# Altium schematic sheet logi-edu.SchDoc: LOGi - EDU
size B; Engineer: M. Jones; Organization: Michael Jones; DocumentNumber: 2; Revision: RA.1; SheetNumber: 2; SheetTotal: 2; PageSetup: Record=PageOptions|CenterHorizontal=True|CenterVertical=True|PrintScale=0.70|XCorrection=1.00|YCorrection=1.00|PrintKind=0|BorderSize=5000000|LeftOffset=0|BottomOffset=0|Orientation=2|PaperLength=1000|PaperWidth=1000|Scale=100|PaperSource=7|PrintQuality=-4|MediaType=1|DitherType=10|PaperKind=Letter|PrintScaleMode=1
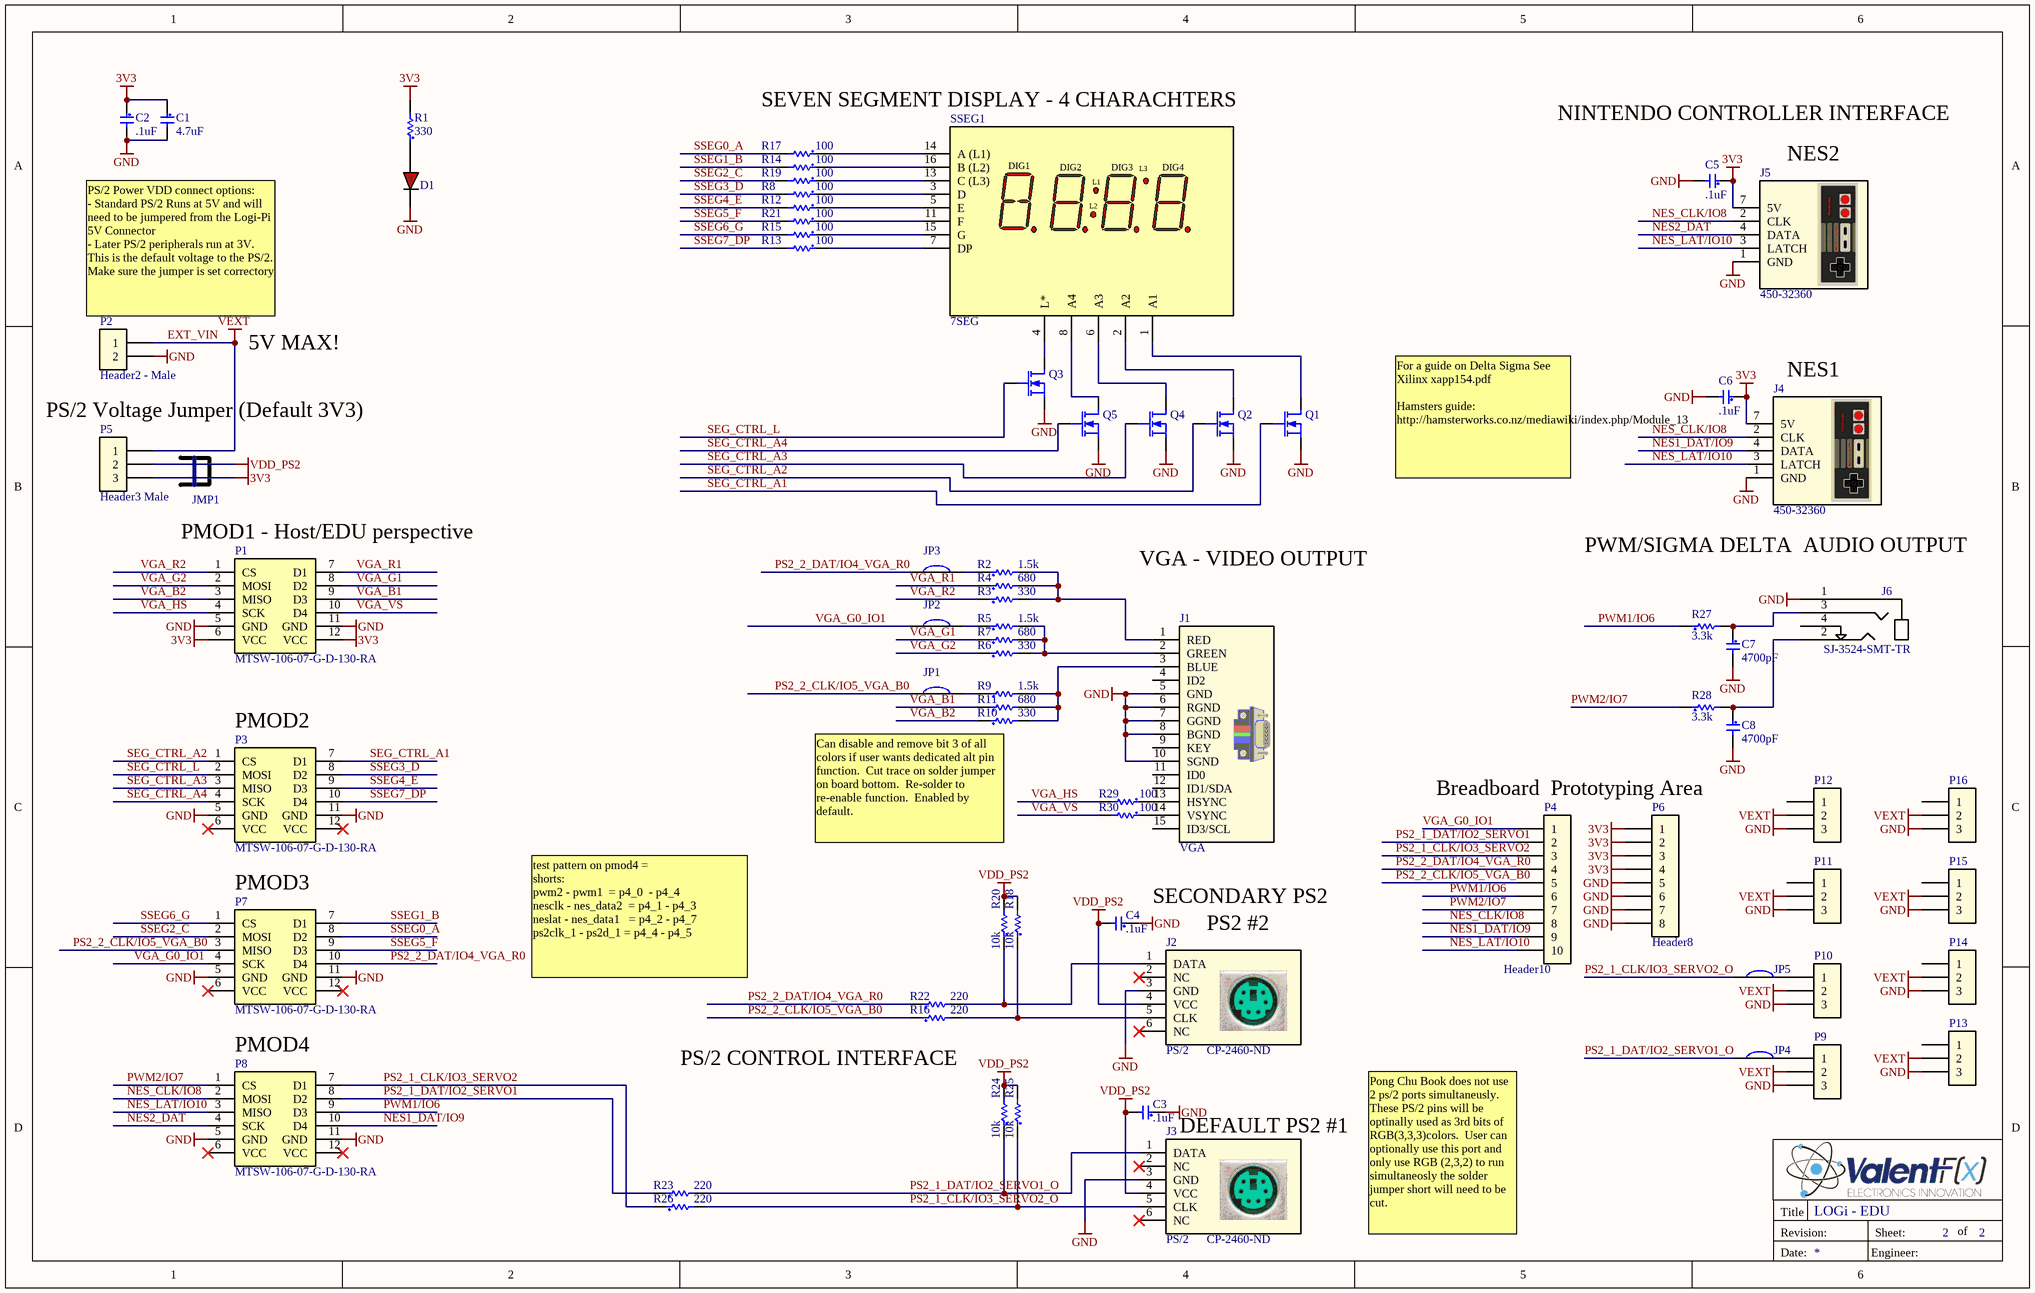
[diagram p0: logi-edu.SchDoc]

## Parts
C1  4.7uF  [C0603]
C2  .1uF  [C0603]
C3  .1uF  [C0603]
C4  .1uF  [C0603]
C5  .1uF  [C0603]
C6  .1uF  [C0603]
C7  4700pF  [C1206]
C8  4700pF  [C1206]
D1  598-8010-107F  [LED_0603 - RED]  (value not drawn)
J1  VGA  [1-1734530-1]
J2  PS/2  Supplier Part Number 1: CP-2460-ND  [MD-60S - PS/2]
J3  PS/2  Supplier Part Number 1: CP-2460-ND  [MD-60S - PS/2]
J4  450-32360  [NES - 450-32360]
J5  450-32360  [NES - 450-32360]
J6  SJ-3524-SMT-TR  [SJ-3524-SMT]
JMP1  Header Jumper  (value not drawn)  (mechanical)
JP1  Solder Jumper-NC  [SOLDER_JUMPER-NC]  (value not drawn)  (net tie, no BOM)
JP2  Solder Jumper-NC  [SOLDER_JUMPER-NC]  (value not drawn)  (net tie, no BOM)
JP3  Solder Jumper-NC  [SOLDER_JUMPER-NC]  (value not drawn)  (net tie, no BOM)
JP4  Solder Jumper-NC  [SOLDER_JUMPER-NC]  (value not drawn)  (net tie, no BOM)
JP5  Solder Jumper-NC  [SOLDER_JUMPER-NC]  (value not drawn)  (net tie, no BOM)
P1  MTSW-106-07-G-D-130-RA  [PMOD HEADER - Male]
P2  Header2 - Male  [HDR - PRPC002SAAN-RC]
P3  MTSW-106-07-G-D-130-RA  [PMOD HEADER - Male]
P4  Header10  [HEADER_10_40_100THRU SIP]  (no BOM)
P5  Header3 Male  [HDR - PRPC003SAAN-RC]
P6  Header8  [HEADER_8_40_100THRU SIP]  (no BOM)
P7  MTSW-106-07-G-D-130-RA  [PMOD HEADER - Male]
P8  MTSW-106-07-G-D-130-RA  [PMOD HEADER - Male]
P9  Header3 Male  [HDR - PRPC003SAAN-RC]  (value not drawn)
P10  Header3 Male  [HDR - PRPC003SAAN-RC]  (value not drawn)
P11  Header3 Male  [HDR - PRPC003SAAN-RC]  (value not drawn)
P12  Header3 Male  [HDR - PRPC003SAAN-RC]  (value not drawn)
P13  Header3 Male  [HDR - PRPC003SAAN-RC]  (value not drawn)
P14  Header3 Male  [HDR - PRPC003SAAN-RC]  (value not drawn)
P15  Header3 Male  [HDR - PRPC003SAAN-RC]  (value not drawn)
P16  Header3 Male  [HDR - PRPC003SAAN-RC]  (value not drawn)
Q1  DMN65D8L-7  [sot-23]  (value not drawn)
Q2  DMN65D8L-7  [sot-23]  (value not drawn)
Q3  DMN65D8L-7  [sot-23]  (value not drawn)
Q4  DMN65D8L-7  [sot-23]  (value not drawn)
Q5  DMN65D8L-7  [sot-23]  (value not drawn)
R1  330  [R0603]
R2  1.5k  [R0603]
R3  330  [R0603]
R4  680  [R0603]
R5  1.5k  [R0603]
R6  330  [R0603]
R7  680  [R0603]
R8  100  [R0603]
R9  1.5k  [R0603]
R10  330  [R0603]
R11  680  [R0603]
R12  100  [R0603]
R13  100  [R0603]
R14  100  [R0603]
R15  100  [R0603]
R16  220  [R0603]
R17  100  [R0603]
R18  10k  [R0603]
R19  100  [R0603]
R20  10k  [R0603]
R21  100  [R0603]
R22  220  [R0603]
R23  220  [R0603]
R24  10k  [R0603]
R25  10k  [R0603]
R26  220  [R0603]
R27  3.3k  [R1206]
R28  3.3k  [R1206]
R29  100  [R0603]
R30  100  [R0603]
SSEG1  7SEG  [LED - SSEG - LTC-4727JR]

## Nets
3V3: C1.1 C2.1 C5.1 C6.1 J4.7(5V) J5.7(5V) P1.6(VCC) P1.12(VCC) P5.3 P6.1 P6.2 P6.3 P6.4 R1.2
EXT_VIN: P2.1 P5.1 P9.2 P10.2 P11.2 P12.2 P13.2 P14.2 P15.2 P16.2  [also labelled VEXT]
GND: C1.2 C2.2 C3.1 C4.1 C5.2 C6.2 C7.2 C8.2 D1.C J1.5(GND) J1.6(RGND) J1.7(GGND) J1.8(BGND) J1.10(SGND) J2.3(GND) J3.3(GND) J4.1(GND) J5.1(GND) J6.1 P1.5(GND) P1.11(GND) P2.2 P3.5(GND) P3.11(GND) P6.5 P6.6 P6.7 P6.8 P7.5(GND) P7.11(GND) P8.5(GND) P8.11(GND) P9.3 P10.3 P11.3 P12.3 P13.3 P14.3 P15.3 P16.3 Q1.2 Q2.2 Q3.2 Q4.2 Q5.2
VDD_PS2: C3.2 C4.2 J2.4(VCC) J3.4(VCC) P5.2 R18.2 R20.2 R24.2 R25.2
NES1_DAT/IO9: J4.4(DATA) P4.9 P8.10(D4)
NES2_DAT: J5.4(DATA) P8.4(SCK)
NES_CLK/IO8: J4.2(CLK) J5.2(CLK) P4.8 P8.2(MOSI)
NES_LAT/IO10: J4.3(LATCH) J5.3(LATCH) P4.10 P8.3(MISO)
PS2_1_CLK/IO3_SERVO2: P4.3 P8.7(D1) R26.1
PS2_1_CLK/IO3_SERVO2_O: J3.5(CLK) JP5.1 R25.1 R26.2
PS2_1_DAT/IO2_SERVO1: P4.2 P8.8(D2) R23.1
PS2_1_DAT/IO2_SERVO1_O: J3.1(DATA) JP4.1 R23.2 R24.1
PS2_2_CLK/IO5_VGA_B0: JP1.1 P4.5 P7.3(MISO) R16.1
PS2_2_DAT/IO4_VGA_R0: JP3.1 P4.4 P7.10(D4) R22.1
PWM1/IO6: P4.6 P8.9(D3) R27.1
PWM2/IO7: P4.7 P8.1(CS) R28.1
SEG_CTRL_A1: P3.7(D1) Q1.1(G)
SEG_CTRL_A2: P3.1(CS) Q2.1(G)
SEG_CTRL_A3: P3.3(MISO) Q4.1(G)
SEG_CTRL_A4: P3.4(SCK) Q5.1(G)
SEG_CTRL_L: P3.2(MOSI) Q3.1(G)
SSEG0_A: P7.8(D2) R17.2
SSEG1_B: P7.7(D1) R14.2
SSEG2_C: P7.2(MOSI) R19.2
SSEG3_D: P3.8(D2) R8.2
SSEG4_E: P3.9(D3) R12.2
SSEG5_F: P7.9(D3) R21.2
SSEG6_G: P7.1(CS) R15.2
SSEG7_DP: P3.10(D4) R13.2
VGA_B1: P1.9(D3) R11.1
VGA_B2: P1.3(MISO) R10.1
VGA_G0_IO1: JP2.1 P4.1 P7.4(SCK)
VGA_G1: P1.8(D2) R7.1
VGA_G2: P1.2(MOSI) R6.1
VGA_HS: P1.4(SCK) R29.2
VGA_R1: P1.7(D1) R4.1
VGA_R2: P1.1(CS) R3.1
VGA_VS: P1.10(D4) R30.2
NetC7_1: C7.1 J6.3 R27.2
NetC8_1: C8.1 J6.2 R28.2
NetD1_A: D1.A R1.1
NetJ1_1: J1.1(RED) R2.2 R3.2 R4.2
NetJ1_2: J1.2(GREEN) R5.2 R6.2 R7.2
NetJ1_3: J1.3(BLUE) R9.2 R10.2 R11.2
NetJ1_13: J1.13(HSYNC) R29.1
NetJ1_14: J1.14(VSYNC) R30.1
NetJ2_1: J2.1(DATA) R20.1 R22.2
NetJ2_5: J2.5(CLK) R16.2 R18.1
NetJP1_2: JP1.2 R9.1
NetJP2_2: JP2.2 R5.1
NetJP3_2: JP3.2 R2.1
NetJP4_2: JP4.2 P9.1
NetJP5_2: JP5.2 P10.1
NetQ1_3: Q1.3(D) SSEG1.1(A1)
NetQ2_3: Q2.3(D) SSEG1.2(A2)
NetQ3_3: Q3.3(D) SSEG1.4(L*)
NetQ4_3: Q4.3(D) SSEG1.6(A3)
NetQ5_3: Q5.3(D) SSEG1.8(A4)
NetR8_1: R8.1 SSEG1.3(D)
NetR12_1: R12.1 SSEG1.5(E)
NetR13_1: R13.1 SSEG1.7(DP)
NetR14_1: R14.1 SSEG1.16(B_(L2))
NetR15_1: R15.1 SSEG1.15(G)
NetR17_1: R17.1 SSEG1.14(A_(L1))
NetR19_1: R19.1 SSEG1.13(C_(L3))
NetR21_1: R21.1 SSEG1.11(F)

Not connected (* = marked no-connect by the designer): J1 4(ID2) 9(KEY) 11(ID0) 12(ID1/SDA) 15(ID3/SCL); J2 2(NC)* 6(NC)*; J3 2(NC)* 6(NC)*; J6 4; P3 6(VCC)* 12(VCC)*; P7 6(VCC)* 12(VCC)*; P8 6(VCC)* 12(VCC)*; P11 1; P12 1; P13 1; P14 1; P15 1; P16 1

## Notes on the sheet
- SEVEN SEGMENT DISPLAY - 4 CHARACHTERS
- NINTENDO CONTROLLER INTERFACE
- NES2
- (near P2) PS/2 Power VDD connect options:
  - Standard PS/2 Runs at 5V and will need to be jumpered from the Logi-Pi 5V Connector
  - Later PS/2 peripherals run at 3V.  This is the default voltage to the PS/2.  Make sure the jumper is set correctory
- 5V MAX!
- PS/2 Voltage Jumper (Default 3V3)
- NES1
- For a guide on Delta Sigma See Xilinx xapp154.pdf
  Hamsters guide:
  http://hamsterworks.co.nz/mediawiki/index.php/Module_13
- (near P1) PMOD1 - Host/EDU perspective
- VGA - VIDEO OUTPUT
- PWM/SIGMA DELTA  AUDIO OUTPUT
- (near P3) PMOD2
- (near R10) Can disable and remove bit 3 of all colors if user wants dedicated alt pin function.  Cut trace on solder jumper on board bottom.  Re-solder to re-enable function.  Enabled by default.
- Breadboard  Prototyping Area
- PMOD3
- (near C4) SECONDARY PS2
- test pattern on pmod4 =
  shorts:
  pwm2 - pwm1 	= p4_0  - p4_4
  nesclk - nes_data2 	= p4_1 - p4_3
  neslat - nes_data1  	= p4_2 - p4_7
  ps2clk_1 - ps2d_1	= p4_4 - p4_5
- (near J2) PS2 #2
- PMOD4
- PS/2 CONTROL INTERFACE
- DEFAULT PS2 #1
- Pong Chu Book does not use 2 ps/2 ports simultaneusly.  These PS/2 pins will be optinally used as 3rd bits of RGB(3,3,3)colors.  User can optionally use this port and only use RGB (2,3,2) to run simultaneosly the solder jumper short will need to be cut.
- Title
- Revision:
- Sheet:
- of
- Date:
- Engineer:
- (in symbol LED - SSEG - LTC-4727JR) DIG1; DIG2; DIG3; L3; DIG4; L1; L2

## Library data of the parts
C1 = C0603 - GRM188F51A475ZE20D: 4.7uF 10volts Y5V +80-20% (MLCC) - SMD/SMT 0603; Manufacturer: Murata; Tolerance: - 20 %, + 80 %; Supplier 1: Mouser; Manufacturer Part Number: GRM188F51A475ZE20D; RoHS: RoHS Compliant By Exemption; Category: Multilayer Ceramic Capacitors (MLCC) - SMD/SMT; Stock 1: 32662; Pricing 1: 1=0.257, 50=0.159, 100=0.123, 500=0.065, 1000=0.046, 4000=0.032, 8000=0.028, 12000=0.024 (AUD); Capacitance: 4.7 uF; Dimensions: 0.8 mm W x 1.6 mm L x 0.8 mm H; Operating Temperature Range: - 30 C to + 85 C; Package / Case: 0603 (1608 metric); Packaging: Reel; Product: General Type MLCCs; Series: GRM; Termination Style: SMD/SMT; Voltage Rating: 10 Volts; Product Category: High Capacitance SMD Ceramic Chip Capacitors; Standard Pack Qty: 4000; Temperature Coefficient / Code: Y5V; RoHS - Mouser: E; Minimum Order Quantity: 1; Reeling: True; ComponentLink1URL: http://www.murata.com/products/catalog/pdf/c02e.pdf; ComponentLink1Description: http://www.murata.com/products/catalog/pdf/c02e.pdf; Supplier Part Number 1: 81-GRM188F51A475ZE20; Value: 4.7uF
C2-C6 = C0603 - GRM188R71H104KA93D: 0.1uF 50volts X7R 10% MLCC SMD/SMT 0603; Manufacturer: Murata; Supplier 1: Mouser; Manufacturer Part Number: GRM188R71H104KA93D; RoHS: RoHS Compliant By Exemption; Category: Multilayer Ceramic Capacitors (MLCC) - SMD/SMT; Stock 1: 327594; Pricing 1: 1=0.081, 50=0.054, 100=0.041, 500=0.018, 1000=0.015, 4000=0.012 (AUD); Capacitance: 0.1 uF; Dimensions: 0.8 mm W x 1.6 mm L x 0.8 mm H; Operating Temperature Range: - 55 C to + 125 C; Package / Case: 0603 (1608 metric); Packaging: Reel; Product: General Type MLCCs; Series: GRM; Termination Style: SMD/SMT; Tolerance: 10 %; Voltage Rating: 50 Volts; Product Category: Low & Medium Capacitance SMD Ceramic Chip Capacitors; Standard Pack Qty: 4000; Temperature Coefficient / Code: X7R; RoHS - Mouser: E; Minimum Order Quantity: 1; Reeling: True; ComponentLink1URL: http://www.murata.com/products/catalog/pdf/c02e.pdf; ComponentLink1Description: http://www.murata.com/products/catalog/pdf/c02e.pdf; Supplier Part Number 1: 81-GRM39X104K50D; Value: .1uF
C7 C8 = C1206 - C1206C472K5RACTU: CAP CER 4700PF 50V 10% X7R 1206; Manufacturer: Kemet; Supplier 1: Digi-Key; Manufacturer Part Number: C1206C472K5RACTU; RoHS: RoHS Compliant; Category: Capacitors; Stock 1: 41649; Pricing 1: 1=0.12, 10=0.085, 50=0.0484, 100=0.04, 250=0.03312, 500=0.02806, 1000=0.02323 (USD); Packaging: Cut Tape (CT); Capacitance: 4700pF; Voltage - Rated: 50V; Tolerance: ±10%; Temperature Coefficient: X7R; Mounting Type: Surface Mount, MLCC; Operating Temperature: -55°C ~ 125°C; Applications: General Purpose; Ratings: -; Package / Case: 1206 (3216 Metric); Size / Dimension: 0.126" L x 0.063" W (3.20mm x 1.60mm); Height - Seated (Max): -; Thickness (Max): 0.035" (0.88mm); Lead Spacing: -; Features: -; Lead Style: -; ComponentLink1URL: http://www.kemet.com/datasheets&C1206C472K5RACTU; ComponentLink1Description: http://www.kemet.com/datasheets&C1206C472K5RACTU; Supplier Part Number 1: 399-1230-1-ND; Value: 4700pF
D1 = LED0603 - 598-8010-107F: LED ALINGAP RED CLEAR 0603 SMD; Manufacturer: Dialight; Current - Test: 20mA; Wavelength - Dominant: 635nm; Millicandela Rating: 40mcd; Voltage - Forward (Vf) Typ: 2.2V; Lens Style/Size: Rectangle with Flat Top, 1.1mm x 0.8mm; Viewing Angle: 140°; Accept Replacement: YES - Water Clear; Supplier 1: Digi-Key; Manufacturer Part Number: 598-8010-107F; RoHS: RoHS Compliant; Category: Optoelectronics; Stock 1: 37578; Pricing 1: 1=0.45, 10=0.33, 25=0.264, 100=0.1749, 250=0.1452, 500=0.1056, 1000=0.0825 (USD); Color: Red; Luminous Flux @ Current - Test: -; Wavelength - Peak: -; Lens Type: Clear; Size / Dimension: 1.60mm L x 0.80mm W; Height: 0.70mm; Package / Case: 0603 (1608 Metric); Mounting Type: Surface Mount; Packaging: Digi-Reel®; ComponentLink1URL: http://media.digikey.com/pdf/Data%20Sheets/Dialight%20PDFs/598_Series_0603_Pkg.pdf; ComponentLink1Description: http://media.digikey.com/pdf/Data%20Sheets/Dialight%20PDFs/598_Series_0603_Pkg.pdf; Supplier Part Number 1: 350-2029-6-ND
J1 = VGA - 1-1734530-1: CONN HD D-SUB RCPT R/A 15POS; Manufacturer: TE Connectivity; Connector Style: D-Sub, High Density; Number of Positions: 15; Connector Type: Receptacle, Female Sockets; Flange Feature: Housing/Shell (4-40); Voltage Rating: 125V; Current Rating: 2A; Supplier 1: Digi-Key; Manufacturer Part Number: 1-1734530-1; RoHS: RoHS Compliant; Category: Connectors, Interconnects; Stock 1: 6957; Pricing 1: 1=1.96, 10=1.779, 25=1.67, 50=1.5976, 100=1.525, 250=1.37972, 500=1.2708, 1000=1.08926, 2500=1.01664 (USD); Number of Rows: 3; Shell Size, Connector Layout: 1 (DE, E) High Density; Contact Type: Signal; Mounting Type: Through Hole, Right Angle; Termination: Solder; Features: Board Lock; Shell Material, Finish: Steel, Nickel Plated; Contact Finish: Gold; Contact Finish Thickness: Flash; Ingress Protection: -; Operating Temperature: -55°C ~ 105°C; Housing Material: Thermoplastic; Color: Black; ComponentLink1URL: http://documents.tycoelectronics.com/commerce/DocumentDelivery/DDEController?Action=srchrtrv&DocNm=1734530&DocType=CD&DocLang=EN; ComponentLink1Description: http://documents.tycoelectronics.com/commerce/DocumentDelivery/DDEController?Action=srchrtrv&DocNm=1734530&DocType=CD&DocLang=EN
J2 J3 = Con - D-60S: CONN MINIDIN RECPT UNSHIELD 6POS - PS/2 mouse - keybaord; Manufacturer: CUI Inc; Manufacturer Part Number: MD-60S; Connector Type: Receptacle, Female Sockets; Number of Positions: 6; Current Rating: 2A; Voltage - Rated: 12VDC; Supplier 1: Digi-Key; RoHS: RoHS Compliant; Category: Connectors, Interconnects; Stock 1: 13581; Pricing 1: 1=1.31, 10=1.018, 100=0.7763, 500=0.621, 1000=0.552, 2500=0.45885 (USD); Shell Size - Insert: Mini DIN; Shell Size, MIL: -; Mounting Type: Through Hole, Right Angle; Termination: Solder; Fastening Type: Push-Pull; Orientation: Keyed; Ingress Protection: -; Shell Material, Finish: Polybutylene Terephthalate (PBT); Contact Finish: Silver; Features: -; Packaging: Bulk; Contact Finish Thickness: -; Operating Temperature: -; ComponentLink1URL: http://products.cui.com/GetSpecForDigiKey.aspx?MFGNum=MD-60S; ComponentLink1Description: http://products.cui.com/GetSpecForDigiKey.aspx?MFGNum=MD-60S; Value: PS/2
J4 J5 = 450-32360: NES CONTROLLER SOCKET; Manufacturer: Parallax Inc; Accessory Type: Adapter NES Controller Socket; For Use With/Related Products: Game Systems, Development, Hobby and Education Projects; Supplier 1: Digi-Key; Manufacturer Part Number: 450-32360; RoHS: RoHS Compliant; Category: Programmers, Development Systems; Stock 1: 7; Pricing 1: 1=1.99 (USD); Supplier 2: Mouser; Stock 2: 0; Pricing 2: 1=1.85 (USD); Product Category: Basic Stamp Accessories; RoHS - Mouser: Y; Minimum Order Quantity: 1; Reeling: False; Supplier Part Number 1: 450-32360-ND; Supplier Part Number 2: 619-450-32360; Value: 450-32360
J6 = SJ-3524-SMT-TR: CONN AUDIO JACK 3.5MM STEREO SMD; Manufacturer: CUI Inc; Connector Type: Phone Jack; Gender: Female; Plug/Mating Plug Diameter: 3.50mm (0.141", 1/8", Mini Plug) - Headphone; Number of Positions/Contacts: 3 Conductors, 4 Contacts; Internal Switch(s): Single Switch; Shielding: Unshielded; Color - Contact: Black; Voltage - Rated: 12VDC; Current Rating: 1A; Supplier 1: Digi-Key; Manufacturer Part Number: SJ-3524-SMT-TR; RoHS: RoHS Compliant; Category: Connectors, Interconnects; Stock 1: 49906; Pricing 1: 1=1.37, 10=1.063, 100=0.811, 500=0.64746 (USD); Packaging: Digi-Reel®; Signal Lines: Stereo; Mounting Type: Surface Mount, Right Angle; Termination: Solder; Features: -; Contact Material: Brass; Contact Material - Plating: Silver; Housing Material: Plastic; Housing Color: Black; Operating Temperature: -25°C ~ 85°C; ComponentLink1URL: http://www.cui.com/product/resource/digikeypdf/sj-352x-smt_series.pdf; ComponentLink1Description: http://www.cui.com/product/resource/digikeypdf/sj-352x-smt_series.pdf; Supplier Part Number 1: CP-3524SJDKR-ND
JMP1 = JMP - PC02SYAN: CONN JUMPER SHORTING GOLD FLASH; Manufacturer: Sullins Connector Solutions; Manufacturer Part Number: SPC02SYAN; Gender: Female Sockets; Number of Positions or Pins (Grid): 2 (1 x 2); Pitch: 0.100" (2.54mm); Supplier 1: Digi-Key; RoHS: RoHS Compliant; Category: Connectors, Interconnects; Stock 1: 178937; Pricing 1: 1=0.13, 10=0.077, 25=0.0548, 50=0.0448, 100=0.0385, 250=0.03256, 500=0.0301, 1000=0.0266, 2500=0.021 (USD); Packaging: Bulk; Type: Closed Top; Height: 0.256" (6.50mm); Contact Finish: Gold; Contact Finish Thickness: Flash; Color: Black; ComponentLink1URL: http://www.sullinscorp.com/drawings/134_C02SYAN_11134.pdf; ComponentLink1Description: http://www.sullinscorp.com/drawings/134_C02SYAN_11134.pdf; Supplier Part Number 1: S9001-ND; Value: Header Jumper
JP1-JP5 = Solder Jumper-NC: Solder/Configuration Jumper; Manufacturer: n/a; Manufacturer Part Number: n/a; Source: n/a; Source Part Number: n/a; ROHS Certificate: n/a
P1 P3 P7 P8 = P-MOD - MTSW-106-07-G-D-130-RA: Samtec Male Conn Unshrouded Header HDR 12 POS 2.54mm Solder RA Thru-Hole; Lead Time: 0 weeks; Peak Solder Temperature: 260 deg C; MSL (Moisture Sensitivity Level): N/R; Supplier 1: Arrow; Manufacturer: Samtec; Manufacturer Part Number: MTSW-106-07-G-D-130-RA; RoHS: CHINA ROHS: Compliant / EU ROHS: Compliant; Stock 1: 0; Termination Finish: Au/Ni; China ROHS Lead (X -> above / O -> below threshold): O; China ROHS Mercury (X -> above / O -> below threshold): O; China ROHS Cadmium (X -> above / O -> below threshold): O; China ROHS Hex Chromium (X -> above / O -> below threshold): O; China ROHS PBB (X -> above / O -> below threshold): O; China ROHS PBDE (X -> above / O -> below threshold): O; EU_ROHS_PROD_EXEMPTION_BY_SUPP: N/R; ComponentLink1URL: http://components.arrow.com/partservice/dataview/altium/2717179?apiKey=aa438727d59eed98c4bed826d8d949c84cb5e685b92bf87346a0226bd2658797; ComponentLink1Description: http://components.arrow.com/partservice/dataview/altium/2717179?apiKey=aa438727d59eed98c4bed826d8d949c84cb5e685b92bf87346a0226bd2658797; Supplier Part Number 1: 2717179; =Value: MTSW-106-07-G-D-130-RA; Value: MTSW-106-07-G-D-130-RA
P2 = HDR - PRPC002SAAN-RC: 2POS male CONN HEADER .100" SNGL STR; Manufacturer: Sullins Connector Solutions; Connector Type: Header, Unshrouded; Number of Positions: 2; Number of Positions Loaded: All; Pitch: 0.100" (2.54mm); Supplier 1: Digi-Key; Manufacturer Part Number: PRPC002SAAN-RC; RoHS: RoHS Compliant; Category: Connectors, Interconnects; Stock 1: 0; Pricing 1: 1=0.16, 10=0.145, 100=0.1198, 500=0.09466, 1000=0.08127, 5000=0.07414, 10000=0.07129 (USD); Packaging: Bulk; Contact Type: Male Pin; Number of Rows: 1; Row Spacing: -; Contact Mating Length: 0.230" (5.84mm); Mounting Type: Through Hole; Termination: Solder; Fastening Type: -; Features: -; Contact Finish: Gold; Contact Finish Thickness: Flash; Color: Black; ComponentLink1URL: http://media.digikey.com/PDF/Data%20Sheets/Sullins%20PDFs/xRxCzzzSxxN-RC_ST_11635-B.pdf; ComponentLink1Description: http://media.digikey.com/PDF/Data%20Sheets/Sullins%20PDFs/xRxCzzzSxxN-RC_ST_11635-B.pdf; Supplier Part Number 1: S1011EC-02-ND; Value: Header2 - Male
P4 = Header10: Header 10 pin
P5 P9-P16 = HDR - PRPC003SAAN-RC: 3POS Male CONN HEADER .100" SNGL STR; Manufacturer: Sullins Connector Solutions; Connector Type: Header, Unshrouded; Number of Positions: 3; Number of Positions Loaded: All; Pitch: 0.100" (2.54mm); Supplier 1: Digi-Key; Manufacturer Part Number: PRPC003SAAN-RC; RoHS: RoHS Compliant; Category: Connectors, Interconnects; Stock 1: 0; Pricing 1: 1=0.18, 10=0.16, 100=0.132, 500=0.10438, 1000=0.0896, 5000=0.08174, 10000=0.0786 (USD); Packaging: Bulk; Contact Type: Male Pin; Number of Rows: 1; Row Spacing: -; Contact Mating Length: 0.230" (5.84mm); Mounting Type: Through Hole; Termination: Solder; Fastening Type: -; Features: -; Contact Finish: Gold; Contact Finish Thickness: Flash; Color: Black; ComponentLink1URL: http://media.digikey.com/PDF/Data%20Sheets/Sullins%20PDFs/xRxCzzzSxxN-RC_ST_11635-B.pdf; ComponentLink1Description: http://media.digikey.com/PDF/Data%20Sheets/Sullins%20PDFs/xRxCzzzSxxN-RC_ST_11635-B.pdf; Value: Header3 Male
P6 = Header8: Header 8 pin
Q1-Q5 = NMOS - DMN65D8L-7: MOSFET N-CH 60V 310MA SOT23; Manufacturer: Diodes Incorporated; FET Type: MOSFET N-Channel, Metal Oxide; FET Feature: Logic Level Gate; Rds On (Max) @ Id, Vgs: 3 Ohm @ 115mA, 10V; Vgs(th) (Max) @ Id: 2V @ 250µA; Gate Charge (Qg) @ Vgs: 0.87nC @ 10V; Input Capacitance (Ciss) @ Vds: 22pF @ 25V; Power - Max: 370mW; Current - Continuous Drain (Id) @ 25°C: 310mA (Ta); Supplier 1: Digi-Key; Manufacturer Part Number: DMN65D8L-7; RoHS: RoHS Compliant; Category: Discrete Semiconductor Products; Stock 1: 44228; Pricing 1: 1=0.17, 10=0.156, 25=0.1416, 100=0.102, 250=0.06008, 500=0.04984, 1000=0.03399 (USD); Drain to Source Voltage (Vdss): 60V; Mounting Type: Surface Mount; Package / Case: TO-236-3, SC-59, SOT-23-3; Packaging: Cut Tape (CT); Supplier Device Package: SOT-23; ComponentLink1URL: http://www.diodes.com/datasheets/DMN65D8L.pdf; ComponentLink1Description: http://www.diodes.com/datasheets/DMN65D8L.pdf; Supplier Part Number 1: DMN65D8L-7DICT-ND; Value: DMN65D8L-7
R1 R3 R6 R10 = R0603 - ERJ-3EKF3300V: RES 330 OHM 1/10W 1% 0603 SMD; Manufacturer: Panasonic Electronic Components; Power (Watts): 0.1W, 1/10W; Temperature Coefficient: ±100ppm/°C; Supplier 1: Digi-Key; Manufacturer Part Number: ERJ-3EKF3300V; RoHS: RoHS Compliant; Category: Resistors; Stock 1: 205460; Pricing 1: 1=0.1, 50=0.015, 100=0.0114, 250=0.00844, 500=0.00624, 1000=0.00416, 2500=0.00351 (USD); Packaging: Cut Tape (CT); Resistance (Ohms): 330; Tolerance: ±1%; Composition: Thick Film; Features: -; Package / Case: 0603 (1608 Metric); Supplier Device Package: 0603; Size / Dimension: 0.063" L x 0.031" W (1.60mm x 0.80mm); Height: 0.022" (0.55mm); Number of Terminations: 2; ComponentLink1URL: http://industrial.panasonic.com/www-cgi/jvcr13pz.cgi?E+PZ+3+AOA0002+ERJ3EKF3300V+7+WW; ComponentLink1Description: http://industrial.panasonic.com/www-cgi/jvcr13pz.cgi?E+PZ+3+AOA0002+ERJ3EKF3300V+7+WW; Supplier Part Number 1: P330HCT-ND; Value: 330
R2 R5 R9 = R0603 - ERJ-3EKF1501V: RES 1.5K OHM 1/10W 1% 0603 SMD; Manufacturer: Panasonic Electronic Components; Power (Watts): 0.1W, 1/10W; Temperature Coefficient: ±100ppm/°C; Supplier 1: Digi-Key; Manufacturer Part Number: ERJ-3EKF1501V; RoHS: RoHS Compliant; Category: Resistors; Stock 1: 491710; Pricing 1: 1=0.1, 50=0.015, 100=0.0114, 250=0.00844, 500=0.00624, 1000=0.00416, 2500=0.00351 (USD); Packaging: Digi-Reel®; Resistance (Ohms): 1.5k; Tolerance: ±1%; Composition: Thick Film; Features: -; Package / Case: 0603 (1608 Metric); Supplier Device Package: 0603; Size / Dimension: 0.063" L x 0.031" W (1.60mm x 0.80mm); Height: 0.022" (0.55mm); Number of Terminations: 2; ComponentLink1URL: http://industrial.panasonic.com/www-cgi/jvcr13pz.cgi?E+PZ+3+AOA0002+ERJ3EKF1501V+7+WW; ComponentLink1Description: http://industrial.panasonic.com/www-cgi/jvcr13pz.cgi?E+PZ+3+AOA0002+ERJ3EKF1501V+7+WW; Supplier Part Number 1: P1.50KHDKR-ND; Value: 1.5k
R4 R7 R11 = R0603 - ERJ-3EKF6800V: RES 680 OHM 1/10W 1% 0603 SMD; Manufacturer: Panasonic Electronic Components; Power (Watts): 0.1W, 1/10W; Temperature Coefficient: ±100ppm/°C; Supplier 1: Digi-Key; Manufacturer Part Number: ERJ-3EKF6800V; RoHS: RoHS Compliant; Category: Resistors; Stock 1: 199459; Pricing 1: 1=0.1, 50=0.015, 100=0.0114, 250=0.00844, 500=0.00624, 1000=0.00416, 2500=0.00351 (USD); Packaging: Digi-Reel®; Resistance (Ohms): 680; Tolerance: ±1%; Composition: Thick Film; Features: -; Package / Case: 0603 (1608 Metric); Supplier Device Package: 0603; Size / Dimension: 0.063" L x 0.031" W (1.60mm x 0.80mm); Height: 0.022" (0.55mm); Number of Terminations: 2; ComponentLink1URL: http://industrial.panasonic.com/www-cgi/jvcr13pz.cgi?E+PZ+3+AOA0002+ERJ3EKF6800V+7+WW; ComponentLink1Description: http://industrial.panasonic.com/www-cgi/jvcr13pz.cgi?E+PZ+3+AOA0002+ERJ3EKF6800V+7+WW; Supplier Part Number 1: P680HDKR-ND; Value: 680
R8 R12-R15 R17 R19 R21 R29 R30 = R0603 - CRCW0603100RFKEA: 100 ohms 1% Thick Film Resistors - SMD 1/10watt; Manufacturer: Vishay/Dale; Temperature Coefficient: 100 PPM / K; Power Rating: 0.1 Watt (1/10 Watt); Voltage Rating: 75 Volts; Manufacturer Part Number: CRCW0603100RFKEA; Value: 100; Supplier 1: Mouser; RoHS: RoHS Compliant By Exemption; Category: Thick Film Resistors - SMD; Stock 1: 243353; Pricing 1: 1=0.108, 25=0.054, 100=0.034, 1000=0.020, 2000=0.018, 5000=0.008, 10000=0.007, 50000=0.005 (AUD); Tolerance: 1 %; Packaging: Reel; Package / Case: 0603 (1608 metric); ComponentLink1URL: http://www.vishay.com/doc?20035; ComponentLink1Description: http://www.vishay.com/doc?20035; Supplier Part Number 1: 71-CRCW0603-100-E3; Dimensions: 0.85 mm W x 1.55 mm L x 0.45 mm H; Operating Temperature Range: - 55 C to + 155 C; Product: Thick Film Resistors SMD; Resistance: 100 Ohms; Series: CRCW; Termination Style: SMD/SMT; Product Category: 0603 Thick Film Chip Resistors; Standard Pack Qty: 5000; RoHS - Mouser: E; Minimum Order Quantity: 1; Reeling: True
R16 R22 R23 R26 = R0603 - ERJ-3EKF2200V: 220 - thick Film Resistors - SMD 0603 220ohms 1% Tol; Manufacturer: Panasonic - ECG; Power (Watts): 0.1W, 1/10W; Temperature Coefficient: ±100ppm/°C; Supplier 1: Digi-Key; Manufacturer Part Number: ERJ-3EKF2200V; RoHS: RoHS Compliant; Category: Resistors; Stock 1: 517798; Pricing 1: 1=0.1, 50=0.0138, 100=0.0105, 250=0.0078, 500=0.00576, 1000=0.00384 (USD); Resistance (Ohms): 220; Composition: Thick Film; Features: -; Tolerance: ±1%; Package / Case: 0603 (1608 Metric); Size / Dimension: 0.063" L x 0.031" W (1.60mm x 0.80mm); Height: 0.022" (0.55mm); Number of Terminations: 2; Packaging: Cut Tape (CT); ComponentLink1URL: http://industrial.panasonic.com/www-cgi/jvcr13pz.cgi?E+PZ+3+AOA0002+ERJ3EKF2200V+7+WW; ComponentLink1Description: http://industrial.panasonic.com/www-cgi/jvcr13pz.cgi?E+PZ+3+AOA0002+ERJ3EKF2200V+7+WW; Supplier Part Number 1: P220HCT-ND; Value: 220
R18 R20 R24 R25 = R0603 - CRCW060310K0FKEA: 10k Thick Film Resistors - SMD 1/10watt 10Kohms 1%; Manufacturer: Vishay Dale; Power (Watts): 0.1W, 1/10W; Temperature Coefficient: ±100ppm/°C; Supplier 1: Digi-Key; Manufacturer Part Number: CRCW060310K0FKEA; RoHS: RoHS Compliant; Category: Resistors; Stock 1: 997856; Pricing 1: 10=0.081, 50=0.0436, 200=0.0251, 1000=0.01711 (USD); Resistance (Ohms): 10K; Composition: Thick Film; Features: -; Tolerance: ±1%; Package / Case: 0603 (1608 Metric); Size / Dimension: 0.061" L x 0.033" W (1.55mm x 0.85mm); Height: 0.020" (0.50mm); Number of Terminations: 2; Packaging: Cut Tape (CT); ComponentLink1URL: http://www.vishay.com/doc?20035; ComponentLink1Description: http://www.vishay.com/doc?20035; Supplier Part Number 1: 541-10.0KHCT-ND; Value: 10k
R27 R28 = R1206 - ERJ-8ENF3301V: RES 3.3K OHM 1/4W 1% 1206 SMD; Manufacturer: Panasonic Electronic Components; Power (Watts): 0.25W, 1/4W; Temperature Coefficient: ±100ppm/°C; Supplier 1: Digi-Key; Manufacturer Part Number: ERJ-8ENF3301V; RoHS: RoHS Compliant; Category: Resistors; Stock 1: 147970; Pricing 1: 1=0.1, 50=0.0368, 100=0.028, 250=0.0208, 500=0.01536, 1000=0.01024 (USD); Packaging: Digi-Reel®; Resistance (Ohms): 3.3k; Tolerance: ±1%; Composition: Thick Film; Features: -; Package / Case: 1206 (3216 Metric); Supplier Device Package: 1206; Size / Dimension: 0.126" L x 0.063" W (3.20mm x 1.60mm); Height: 0.028" (0.70mm); Number of Terminations: 2; ComponentLink1URL: http://industrial.panasonic.com/www-cgi/jvcr13pz.cgi?E+PZ+3+AOA0002+ERJ8ENF3301V+7+WW; ComponentLink1Description: http://industrial.panasonic.com/www-cgi/jvcr13pz.cgi?E+PZ+3+AOA0002+ERJ8ENF3301V+7+WW; Supplier Part Number 1: P3.30KFDKR-ND; Value: 3.3k
SSEG1 = LED - SSEG - LTC-4727JR: LED Displays & Accessories 4 Digit, Red Low Current; Manufacturer: Lite-On; Character Size: 10 mm; Display Type: 7 Segment; Operating Voltage: 2 V; Power Consumption: 70 mW; Wavelength: 631 nm; Common Pin: Common Cathode; Luminous Intensity: 975 ucd; Operating Current: 25 mA; Number of Digits: 4; Supplier 1: Mouser; Manufacturer Part Number: LTC-4727JR; RoHS: RoHS Compliant; Category: LED Displays & Accessories; Stock 1: 1398; Pricing 1: 1=2.88, 10=2.74, 50=2.67, 100=2.61, 500=2.31 (AUD); Illumination Color: Red; Packaging: Tube; Maximum Operating Temperature: + 85 C; Minimum Operating Temperature: - 35 C; Product Category: Numeric Display; Standard Pack Qty: 12; RoHS - Mouser: Y; Minimum Order Quantity: 1; Reeling: False; ComponentLink1URL: http://optoelectronics.liteon.com/en-us/product/detail.aspx?txtSpecNo=DS30-2000-193&txtPartNo=LTC-4727JR; ComponentLink1Description: http://optoelectronics.liteon.com/en-us/product/detail.aspx?txtSpecNo=DS30-2000-193&txtPartNo=LTC-4727JR